# EAGLE design node2 (EAGLE 5.10)
OSRAM-LGN971: GREEN
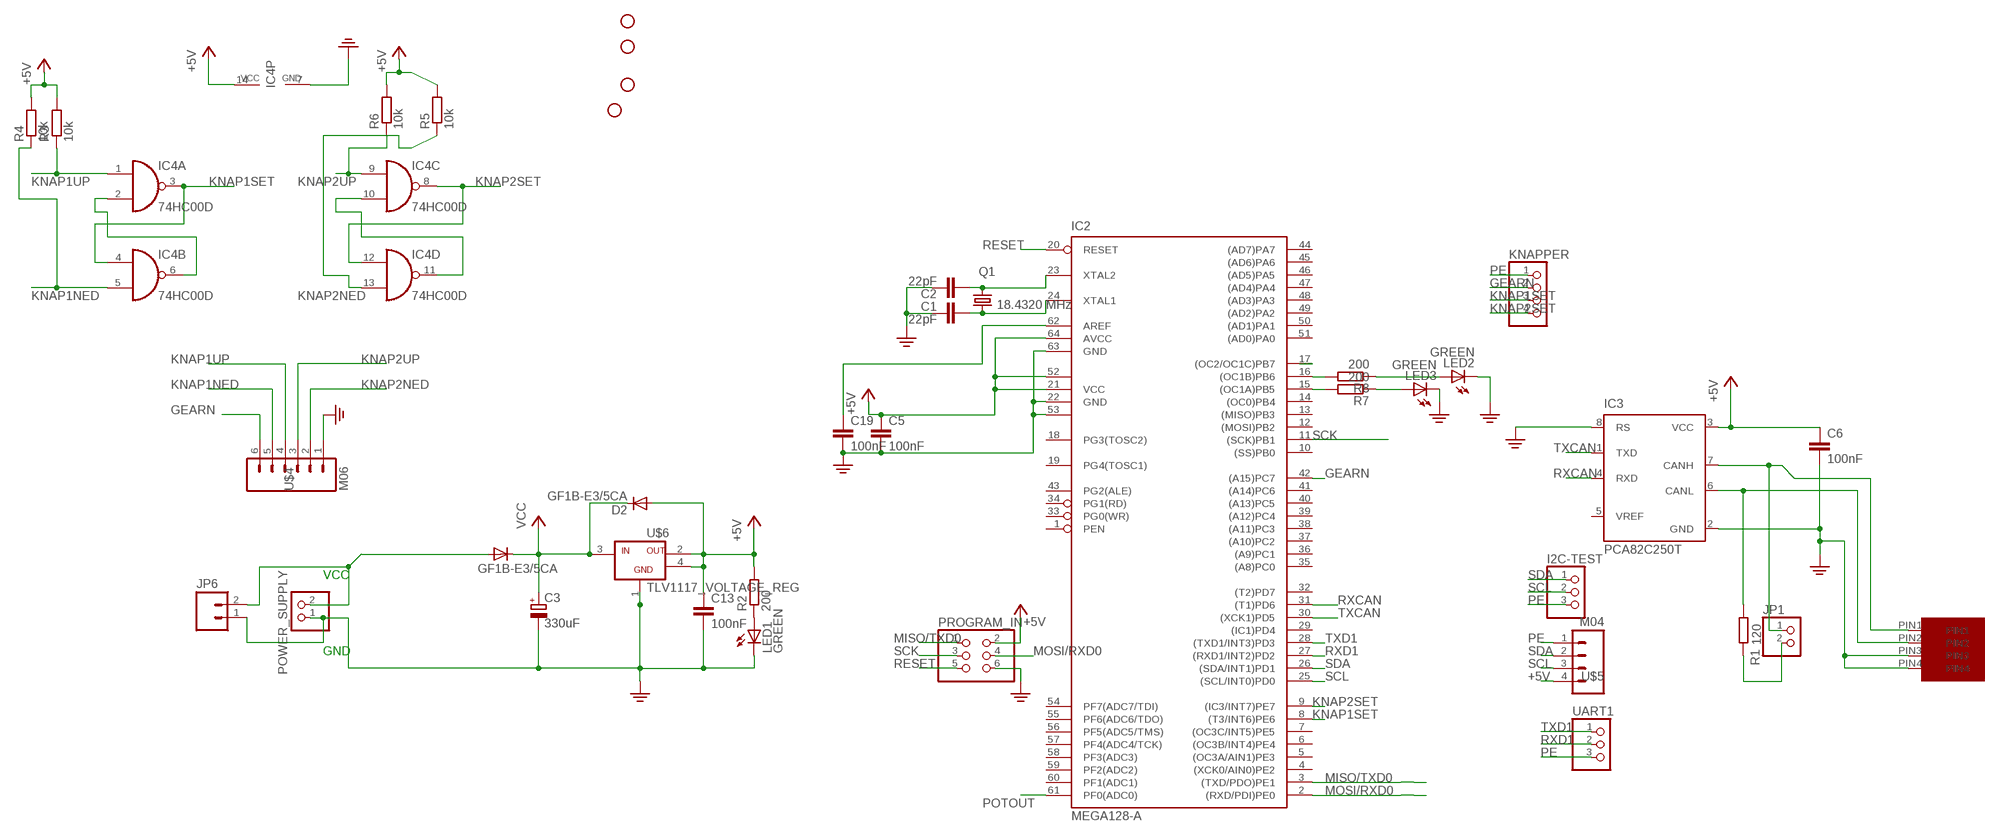
[diagram p0: schematic, sheet 1]

## Parts
C1  22pF  C5/2.5  [C5B2.5]
C2  22pF  C5/2.5  [C5B2.5]
C3  330uF  CPOL-EUE15-5AXIAL  [E15-5]
C5  100nF  C-EUC0603K  [C0603K]
C6  100nF  C-EUC0603K  [C0603K]
C13  100nF  C-EUC0603K  [C0603K]
C19  100nF  C-EUC0603K  [C0603K]
D1  GF1B-E3/5CA  DIODE-GF1  [GF1]
D2  GF1B-E3/5CA  DIODE-GF1  [GF1]
I2C-TEST  PINHD-1X3  [1X03]
IC2  MEGA128-A  [TQFP64]
IC3  PCA82C250T  [SO8]
IC4  74HC00D  [SO14]
JP1  PINHD-1X2  [1X02]
JP2  STAND-OFF  [STAND-OFF]
JP3  STAND-OFF  [STAND-OFF]
JP4  STAND-OFF  [STAND-OFF]
JP5  STAND-OFF  [STAND-OFF]
JP6  M02-JST-2MM-SMT  [S2B-PH]
KNAPPER  PINHD-1X4  [1X04]
LED1  GREEN  LEDSMT1206  [1206]
LED2  GREEN  LEDSMT1206  [1206]
LED3  GREEN  LEDSMT1206  [1206]
POWER_SUPPLY  PINHD-1X2  [1X02]
PROGRAM_IN  PINHD-2X3  [2X03]
Q1  18.4320 MHz  CRYSTALHC49U70  [HC49U70]
R1  120  R-EU_R0603  [R0603]
R2  200  R-EU_R0603  [R0603]
R3  10k  R-EU_R0603  [R0603]
R4  10k  R-EU_R0603  [R0603]
R5  10k  R-EU_R0603  [R0603]
R6  10k  R-EU_R0603  [R0603]
R7  200  R-EU_R0603  [R0603]
R8  200  R-EU_R0603  [R0603]
U$1  MICROFIT4  [MICROFIT4SOCK]
U$4  M06  [S6B_PH]
U$5  M04  [S4B-PH]
U$6  TLV1117_VOLTAGE_REG  [SOT-232]
UART1  PINHD-1X3  [1X03]

## Nets
+5V: C5.1 C6.1 C13.1 D2.A IC2.21(VCC) IC2.52(VCC1) IC2.64(AVCC) IC3.3(VCC) IC4.14(P:VCC) PROGRAM_IN.2 R2.2 R3.2 R4.2 R5.2 R6.2 U$5.4 U$6.2(VOUT) U$6.4(OUT2)
CANJUMP1: IC3.7(CANH) JP1.1 U$1.PIN1
CANJUMP2: JP1.2 R1.2
GEARN: IC2.42((A15)PC7) KNAPPER.2 U$4.6
KNAP1NED: IC4.5(B:I1) R4.1 U$4.5
KNAP1SET: IC2.8((T3/INT6)PE6) IC4.3(A:O) IC4.4(B:I0) KNAPPER.3
KNAP1UP: IC4.1(A:I0) R3.1 U$4.4
KNAP2NED: IC4.13(D:I1) R5.1 U$4.2
KNAP2SET: IC2.9((IC3/INT7)PE7) IC4.8(C:O) IC4.12(D:I0) KNAPPER.4
KNAP2UP: IC4.9(C:I0) R6.1 U$4.3
MISO/TXD0: IC2.3((TXD/PDO)PE1) PROGRAM_IN.1
MOSI/RXD0: IC2.2((RXD/PDI)PE0) PROGRAM_IN.4
N$1: C1.2 IC2.24(XTAL1) Q1.1
N$2: C2.2 IC2.23(XTAL2) Q1.2
N$3: D1.A JP6.2 POWER_SUPPLY.2
N$4: IC2.16((OC1B)PB6) R8.2
N$5: IC2.15((OC1A)PB5) R7.2
N$6: LED1.A R2.1
N$7: LED2.A R8.1
N$9: IC2.17((OC2/OC1C)PB7)
N$10: C19.1 IC2.62(AREF)
N$11: LED3.A R7.1
N$13: IC4.2(A:I1) IC4.6(B:O)
N$15: IC4.10(C:I1) IC4.11(D:O)
N$51: IC3.6(CANL) R1.1 U$1.PIN2
PE: C1.1 C2.1 C3.- C5.2 C6.2 C13.2 C19.2 I2C-TEST.3 IC2.22(GND) IC2.53(GND1) IC2.63(GND) IC3.2(GND) IC3.8(RS) IC4.7(P:GND) JP6.1 KNAPPER.1 LED1.C LED2.C LED3.C POWER_SUPPLY.1 PROGRAM_IN.6 U$1.PIN3 U$1.PIN4 U$4.1 U$5.1 U$6.1(GND) UART1.3
POTOUT: IC2.61(PF0(ADC0))
RESET: IC2.20(RESET) PROGRAM_IN.5
RXCAN: IC2.31((T1)PD6) IC3.4(RXD)
RXD1: IC2.27((RXD1/INT2)PD2) UART1.2
SCK: IC2.11((SCK)PB1) PROGRAM_IN.3
SCL: I2C-TEST.2 IC2.25((SCL/INT0)PD0) U$5.3
SDA: I2C-TEST.1 IC2.26((SDA/INT1)PD1) U$5.2
TXCAN: IC2.30((XCK1)PD5) IC3.1(TXD)
TXD1: IC2.28((TXD1/INT3)PD3) UART1.1
VCC: C3.+ D1.C D2.C U$6.3(VIN)
Unconnected: IC2.1(PEN) IC2.4((XCK0/AIN0)PE2) IC2.5((OC3A/AIN1)PE3) IC2.6((OC3B/INT4)PE4) IC2.7((OC3C/INT5)PE5) IC2.10((SS)PB0) IC2.12((MOSI)PB2) IC2.13((MISO)PB3) IC2.14((OC0)PB4) IC2.18(PG3(TOSC2)) IC2.19(PG4(TOSC1)) IC2.29((IC1)PD4) IC2.32((T2)PD7) IC2.33(PG0(WR)) IC2.34(PG1(RD)) IC2.35((A8)PC0) IC2.36((A9)PC1) IC2.37((A10)PC2) IC2.38((A11)PC3) IC2.39((A12)PC4) IC2.40((A13)PC5) IC2.41((A14)PC6) IC2.43(PG2(ALE)) IC2.44((AD7)PA7) IC2.45((AD6)PA6) IC2.46((AD5)PA5) IC2.47((AD4)PA4) IC2.48((AD3)PA3) IC2.49((AD2)PA2) IC2.50((AD1)PA1) IC2.51((AD0)PA0) IC2.54(PF7(ADC7/TDI)) IC2.55(PF6(ADC6/TDO)) IC2.56(PF5(ADC5/TMS)) IC2.57(PF4(ADC4/TCK)) IC2.58(PF3(ADC3)) IC2.59(PF2(ADC2)) IC2.60(PF1(ADC1)) IC3.5(VREF)

## Notes on the sheet
- VCC
- GND

## Library data of the parts
C1 C2 = capacitor-wima:C: CAPACITOR naming: grid - package width
C3 = rcl:CPOL-EU: POLARIZED CAPACITOR, European symbol
C5 C6 C13 C19 = rcl:C-EU: CAPACITOR, European symbol
D1 D2 = diode:DIODE-: DIODE
I2C-TEST UART1 = pinhead:PINHD-1X3: PIN HEADER
IC2 = atmel:MEGA128: MICROCONTROLLER 128 Kbytes FLASH 4 Kbytes SRAM 4 Kbytes EEPROM DUAL USART 8-channel 10 bit ADC Source: avr.lbr
IC3 = micro-philips:PCA82C250: CAN CONTROLLER INTERFACE
IC4 = 74xx-eu:74*00: Quad 2-input NAND gate
JP1 POWER_SUPPLY = pinhead:PINHD-1X2: PIN HEADER
JP2-JP5 = SparkFun:STAND-OFF: Stand Off This is the mechanical footprint for a #4 phillips button head screw. Use the keepout ring to avoid running the screw head into surrounding components. SKU : PRT-00447
JP6 = unicorn_v2:M02: Header 2 Standard 2-pin 0.1" header. Use with straight break away headers (SKU : PRT-00116), right angle break away headers (PRT-00553), swiss pins (PRT-00743), machine pins (PRT-00117), and female headers (PRT-00115). Molex polarized connector foot print use with SKU : PRT-08233 with associated crimp pins and housings.
KNAPPER = pinhead:PINHD-1X4: PIN HEADER
LED1-LED3 = led:LED: LED OSRAM: - CHIPLED LG R971, LG N971, LY N971, LG Q971, LY Q971, LO R971, LY R971 LH N974, LH R974 LS Q976, LO Q976, LY Q976 LO Q996 - Hyper CHIPLED LW Q18S LB Q993, LB Q99A, LB R99A - SideLED LS A670, LO A670, LY A670, LG A670, LP A670 LB A673, LV A673, LT A673, LW A673 LH A674 LY A675 LS A676, LA A676, LO A676, LY A676, LW A676 LS A679, LY A679, LG A679 - Hyper Micro SIDELED® LS Y876, LA Y876, LO Y876, LY Y876 LT Y87S - SmartLED LW L88C, LW L88S LB L89C, LB L89S, LG L890 LS L89K, LO L89K, LY L89K LS L896, LA L896, LO L896, LY L896 - TOPLED LS T670, LO T670, LY T670, LG T670, LP T670 LSG T670, LSP T670, LSY T670, LOP T670, LYG T670 LG T671, LOG T671, LSG T671 LB T673, LV T673, LT T673, LW T673 LH T674 LS T676, LA T676, LO T676, LY T676, LB T676, LH T676, LSB T676, LW T676 LB T67C, LV T67C, LT T67C, LS T67K, LO T67K, LY T67K, LW E67C LS E67B, LA E67B, LO E67B, LY E67B, LB E67C, LV E67C, LT E67C LW T67C LS T679, LY T679, LG T679 LS T770, LO T770, LY T770, LG T770, LP T770 LB T773, LV T773, LT T773, LW T773 LH T774 LS E675, LA E675, LY E675, LS T675 LS T776, LA T776, LO T776, LY T776, LB T776 LHGB T686 LT T68C, LB T68C - Hyper Mini TOPLED® LB M676 - Mini TOPLED Santana® LG M470 LS M47K, LO M47K, LY M47K Source: http://www.osram.convergy.de LUXEON: - LUMILED® LXK2-PW12-R00, LXK2-PW12-S00, LXK2-PW14-U00, LXK2-PW14-V00 LXK2-PM12-R00, LXK2-PM12-S00, LXK2-PM14-U00 LXK2-PE12-Q00, LXK2-PE12-R00, LXK2-PE12-S00, LXK2-PE14-T00, LXK2-PE14-U00 LXK2-PB12-K00, LXK2-PB12-L00, LXK2-PB12-M00, LXK2-PB14-N00, LXK2-PB14-P00, LXK2-PB14-Q00 LXK2-PR12-L00, LXK2-PR12-M00, LXK2-PR14-Q00, LXK2-PR14-R00 LXK2-PD12-Q00, LXK2-PD12-R00, LXK2-PD12-S00 LXK2-PH12-R00, LXK2-PH12-S00 LXK2-PL12-P00, LXK2-PL12-Q00, LXK2-PL12-R00 Source: www.luxeon.com KINGBRIGHT: KA-3528ASYC Source: www.kingbright.com
PROGRAM_IN = pinhead:PINHD-2X3: PIN HEADER
Q1 = crystal:CRYSTAL: CRYSTAL
R1 = resistor:R-EU_: RESISTOR, European symbol
R2-R8 = rcl:R-EU_: RESISTOR, European symbol
U$1 = UNICORN:MICROFIT4
U$4 = unicorn_v2:M06
U$5 = unicorn_v2:M04
U$6 = unicorn_v2:TLV1117_VOLTAGE_REG

## Board
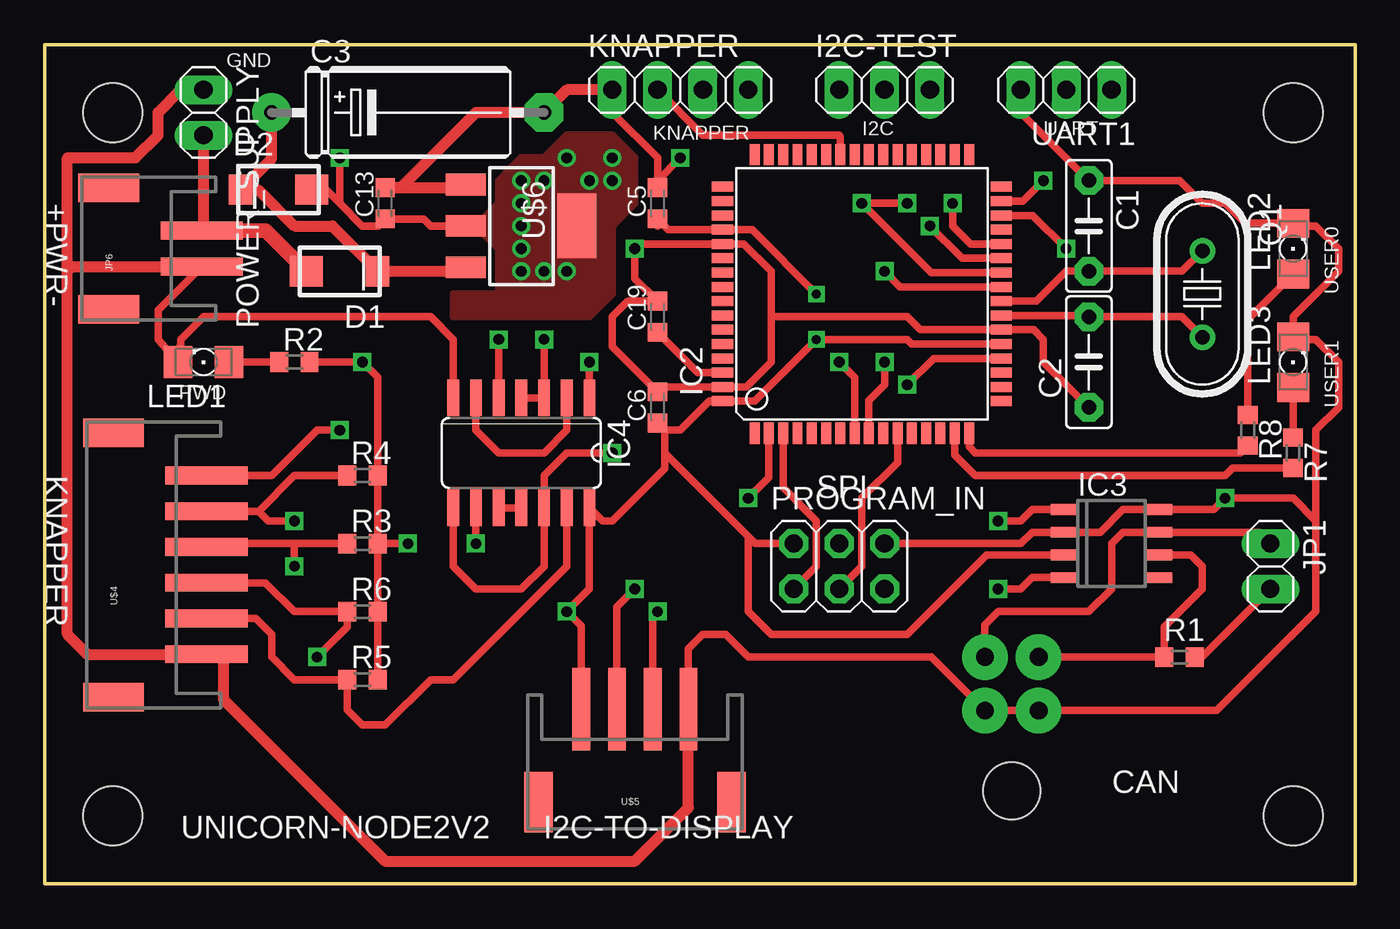
[diagram p1: board, top side]
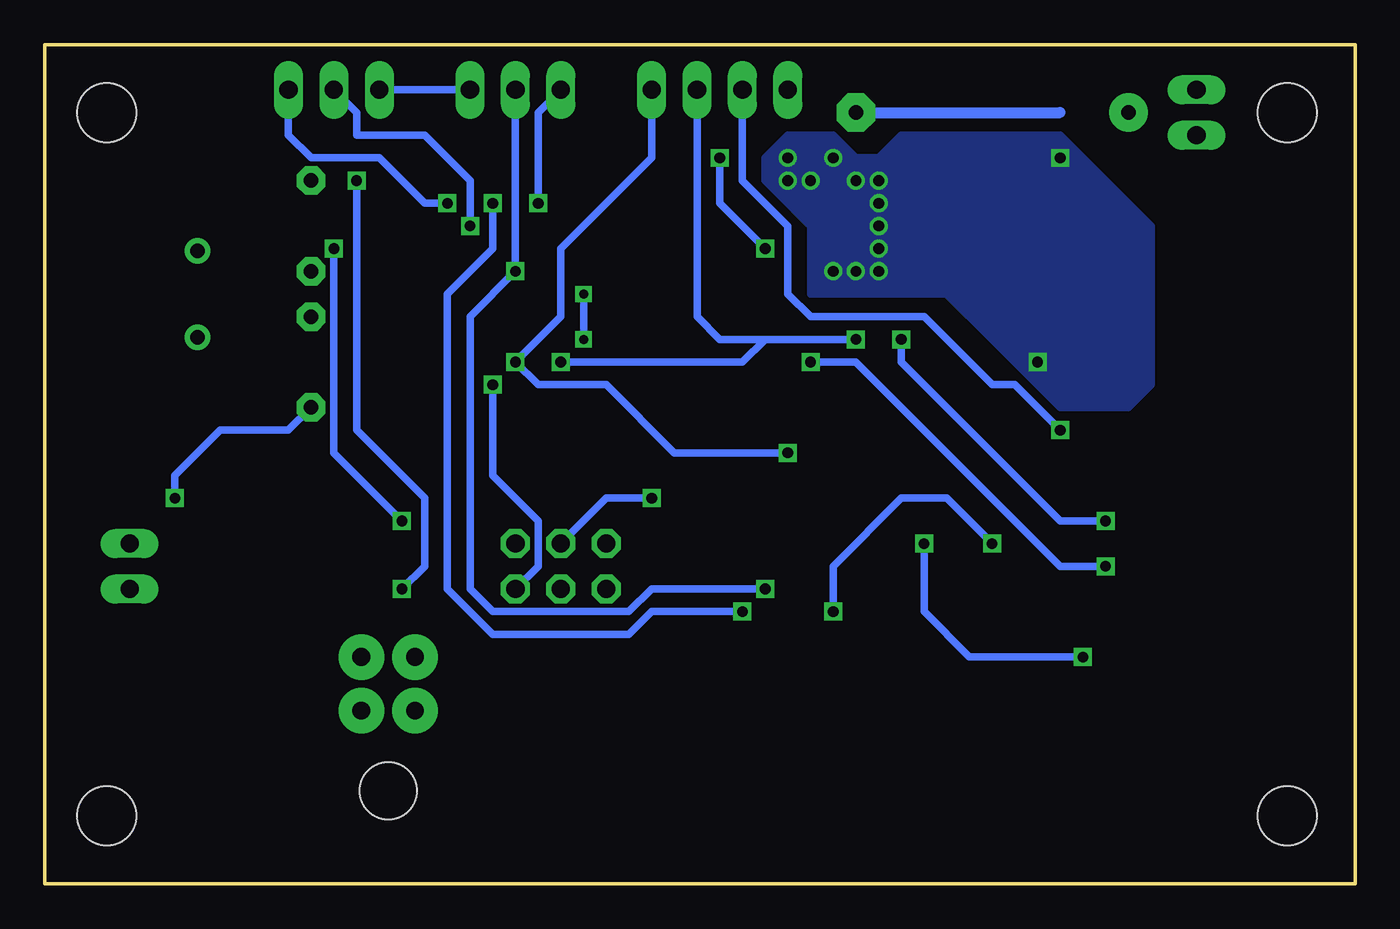
[diagram p2: board, bottom side, seen from below]

Size 73.33 x 46.98 mm. Coordinates in mm from the lower left corner, seen from the top.
Outline: 0,0 73.33,0 73.33,46.98 0,46.98 0,0
Copper layers (1*16): Top 0.035mm / dielectric 1.5mm / Bottom 0.035mm
Design rules "unicorn *": minimum track width 10mil, minimum drill 20mil, track to track 8mil, track to pad 8mil, pad to pad 8mil, via to via 8mil, smd to smd 8mil, copper to edge 10mil, drill to drill 8mil, minimum pad ring 12mil, minimum via ring 8mil, stop-mask expansion 4mil, vias tented up to drill 0mil, thermal gap 10mil

### Footprints (pad centres in the part's own frame; a part is rotated, then mirrored left to right if it is on the bottom)
C5B2.5 = drill 0.813 pad 1.6 octagon: 1 -2.54,0; 2 2.54,0
E15-5 = drill 0.813 pad 2.159 round: + -7.62,0 | drill 0.813 pad 2.159 octagon: - 7.62,0
C0603K = smd 1.05 x 1.08: 1 -0.875,0; 2 0.875,0
GF1 = smd 1.85 x 1.68: A 1.87,0 | smd 1.32 x 1.68: C -2.12,0
1X03 = drill 1.016 long: 1 -2.54,0; 2 0,0; 3 2.54,0
TQFP64 = smd 1.194 x 0.559: 1 -7.8,6; 2 -7.8,5.2; 3 -7.8,4.4; 4 -7.8,3.6; 5 -7.8,2.8; 6 -7.8,2; 7 -7.8,1.2; 8 -7.8,0.4; 9 -7.8,-0.4; 10 -7.8,-1.2; 11 -7.8,-2; 12 -7.8,-2.8; 13 -7.8,-3.6; 14 -7.8,-4.4; 15 -7.8,-5.2; 16 -7.8,-6; 33 7.8,-6; 34 7.8,-5.2; 35 7.8,-4.4; 36 7.8,-3.6; 37 7.8,-2.8; 38 7.8,-2; 39 7.8,-1.2; 40 7.8,-0.4; 41 7.8,0.4; 42 7.8,1.2; 43 7.8,2; 44 7.8,2.8; 45 7.8,3.6; 46 7.8,4.4; 47 7.8,5.2; 48 7.8,6 | smd 0.559 x 1.194: 17 -6,-7.8; 18 -5.2,-7.8; 19 -4.4,-7.8; 20 -3.6,-7.8; 21 -2.8,-7.8; 22 -2,-7.8; 23 -1.2,-7.8; 24 -0.4,-7.8; 25 0.4,-7.8; 26 1.2,-7.8; 27 2,-7.8; 28 2.8,-7.8; 29 3.6,-7.8; 30 4.4,-7.8; 31 5.2,-7.8; 32 6,-7.8; 49 6,7.8; 50 5.2,7.8; 51 4.4,7.8; 52 3.6,7.8; 53 2.8,7.8; 54 2,7.8; 55 1.2,7.8; 56 0.4,7.8; 57 -0.4,7.8; 58 -1.2,7.8; 59 -2,7.8; 60 -2.8,7.8; 61 -3.6,7.8; 62 -4.4,7.8; 63 -5.2,7.8; 64 -6,7.8
SO8 = smd 0.6 x 1.6: 1 -1.905,-2.6; 2 -0.635,-2.6; 3 0.635,-2.6; 4 1.905,-2.6; 5 1.905,2.6; 6 0.635,2.6; 7 -0.635,2.6; 8 -1.905,2.6
SO14 = smd 0.66 x 2.032: 1 -3.81,-3.073; 2 -2.54,-3.073; 3 -1.27,-3.073; 4 0,-3.073; 5 1.27,-3.073; 6 2.54,-3.073; 7 3.81,-3.073; 8 3.81,3.073; 9 2.54,3.073; 10 1.27,3.073; 11 0,3.073; 12 -1.27,3.073; 13 -2.54,3.073; 14 -3.81,3.073
1X02 = drill 1.016 long: 1 -1.27,0; 2 1.27,0
STAND-OFF = hole 3.302: 0,0
S2B-PH = smd 1 x 4.6: 1 -1,-3.7; 2 1,-3.7 | smd 1.6 x 3.4: NC1 -3.4,1.5; NC2 3.4,1.5
1X04 = drill 1.016 long: 1 -3.81,0; 2 -1.27,0; 3 1.27,0; 4 3.81,0
1206 = smd 1.6 x 1.803: A -1.422,0; C 1.422,0
2X03 = drill 1.016 octagon: 1 -2.54,-1.27; 2 -2.54,1.27; 3 0,-1.27; 4 0,1.27; 5 2.54,-1.27; 6 2.54,1.27
HC49U70 = drill 0.813 round: 1 -2.413,0; 2 2.413,0
R0603 = smd 1 x 1.1: 1 -0.85,0; 2 0.85,0
MICROFIT4SOCK = drill 1 pad 2.54 round: PIN1 -2,0; PIN2 1,0; PIN3 -2,-3; PIN4 1,-3 | hole 3.2: -0.5,-7.5
S6B_PH = smd 1 x 4.6: 1 -4.92,-2.7; 2 -2.92,-2.7; 3 -0.92,-2.7; 4 1.08,-2.7; 5 3.08,-2.7; 6 5.08,-2.7 | smd 1.6 x 3.4: NC1 -7.32,2.5; NC2 7.48,2.5
S4B-PH = smd 1 x 4.6: 1 -3,-2.16; 2 -1,-2.16; 3 1,-2.16; 4 3,-2.16 | smd 1.6 x 3.4: NC1 -5.4,3.04; NC2 5.4,3.04
SOT-232 = smd 1.219 x 2.235: 1 -2.311,-3.099; 2 0,-3.099; 3 2.311,-3.099 | smd 3.6 x 2.2: 4 0,3.099

### Placement (x,y rotation side)
C1  58.42,36.83 270 top
C2  58.42,29.21 90 top
C3  20.32,43.18 0 top
C5  34.29,38.1 90 top
C6  34.29,26.67 90 top
C13  19.05,38.1 90 top
C19  34.29,31.75 90 top
D1  16.51,34.29 180 top
D2  13.08,38.86 0 top
I2C-TEST  46.99,44.45 0 top
IC2  45.72,33.02 90 top
IC3  59.69,19.05 270 top
IC4  26.67,24.13 180 top
JP1  68.58,17.78 270 top
JP2  3.81,3.81 0 top
JP3  69.85,3.81 0 top
JP4  3.81,43.18 0 top
JP5  69.85,43.18 0 top
JP6  5.08,35.56 90 top
KNAPPER  35.56,44.45 0 top
LED1  8.89,29.21 180 top
LED2  69.85,35.56 90 top
LED3  69.85,29.21 90 top
POWER_SUPPLY  8.89,43.18 270 top
PROGRAM_IN  44.45,17.78 0 top
Q1  64.77,33.02 270 top
R1  63.5,12.7 0 top
R2  13.97,29.21 0 top
R3  17.78,19.05 0 top
R4  17.78,22.86 0 top
R5  17.78,11.43 0 top
R6  17.78,15.24 0 top
R7  69.85,24.13 270 top
R8  67.31,25.4 270 top
U$1  54.61,12.7 0 top
U$4  6.35,17.78 90 top
U$5  33.02,7.62 180 top
U$6  26.67,36.83 270 top
UART1  57.15,44.45 180 top

### Tracks (layer width: path | path; a pad name or v marks a point on that pad's centre or on a via)
+5V  (via drill 0.51, 0.6)
  Top 0.406: 16.51,38.1 17.78,36.83 18.66,36.83 C13.1 21.2,37.23 21.59,36.83 U$6.2 | R5.2 R6.2 R3.2 | R3.2 R4.2 18.63,28.36 v17.78,29.21 R2.2 | IC2.21 48.52,30.22 48.26,30.48 v43.18,30.48 39.72,27.02 IC2.64 37.18,27.02 35.56,25.4 34.69,25.4 | 34.69,25.4 C6.1 | 16.51,38.1 v16.51,40.64 | 34.69,24.13 34.69,25.4 | 34.69,24.13 34.69,23.25 31.75,20.32 31.22,20.32 30.85,20.69 | 30.85,20.69 IC4.14 | 30.85,20.69 30.48,20.32 30.48,16.51 v29.21,15.24 30.02,14.43 U$5.4 | PROGRAM_IN.2 39.77,19.05 39.37,19.45 | R3.2 v20.32,19.05 | IC3.3 52.7,18.41 48.26,13.97 40.64,13.97 39.37,15.24 39.37,19.45 | 34.69,24.13 39.37,19.45 | 34.29,36.83 C5.1 34.9,36.62 IC2.52 39.58,36.62 v43.18,33.02 | D2.A 15.75,38.86 16.51,38.1
  Bottom 0.406: v20.32,19.05 22.86,21.59 25.4,21.59 29.21,17.78 v29.21,15.24 | v43.18,30.48 v43.18,33.02
  other vias: 31.75,40.64 31.75,39.37 30.48,39.37 26.67,39.37 27.94,39.37 26.67,38.1 26.67,35.56 26.67,34.29 27.94,34.29 26.67,36.83 29.21,34.29 29.21,40.64
  pour Bottom (no thermals): 31.75,41.91 29.21,41.91 27.94,40.64 26.67,40.64 25.4,41.91 16.51,41.91 11.43,36.83 11.43,27.94 12.7,26.67 16.51,26.67 22.86,33.02 30.48,33.02 30.48,36.83 33.02,39.37 33.02,40.64
  pour Top (isolate 0.305, no thermals): 33.02,38.1 33.02,40.64 31.75,41.91 29.21,41.91 27.94,40.64 26.67,40.64 25.4,39.37 25.4,38.1 24.13,36.83 25.4,35.56 25.4,33.02 22.86,33.02 22.86,31.75 30.48,31.75 31.75,33.02 31.75,36.83
CANJUMP1
  Top 0.406: U$1.PIN1 52.61,14.51 53.34,15.24 58.42,15.24 59.69,16.51 59.69,19.05 60.33,19.68 IC3.7 67.94,19.68 JP1.1
CANJUMP2
  Top 0.406: R1.2 64.77,12.7 JP1.2
GEARN  (via drill 0.6)
  Top 0.406: IC2.42 44.52,41.84 44.45,41.91 36.83,41.91 KNAPPER.2 | v16.51,25.4 15.24,25.4 12.7,22.86 U$4.6
  Bottom 0.406: KNAPPER.2 34.29,39.37 31.75,36.83 31.75,33.02 30.48,31.75 24.13,31.75 20.32,27.94 19.05,27.94 v16.51,25.4
KNAP1NED  (via drill 0.6)
  Top 0.406: U$4.5 11.97,20.86 | 11.97,20.86 13.97,22.86 R4.1 | v25.4,30.48 IC4.5 | v13.97,20.32 12.51,20.32 11.97,20.86
  Bottom 0.406: v13.97,20.32 16.51,20.32 25.4,29.21 v25.4,30.48
KNAP1SET  (via drill 0.6)
  Top 0.406: IC4.4 IC4.3 v27.94,30.48 | IC2.8 45.32,28.34 v44.45,29.21
  Bottom 0.406: v44.45,29.21 34.29,29.21 33.02,30.48 | v27.94,30.48 33.02,30.48 | 33.02,30.48 35.56,30.48 36.83,31.75 KNAPPER.3
KNAP1UP  (via drill 0.6)
  Top 0.406: v30.48,29.21 IC4.1 | 13.97,19.05 v13.97,17.78 | 13.97,19.05 R3.1 | 13.97,19.05 9.24,19.05 U$4.4
  Bottom 0.406: v30.48,29.21 27.94,29.21 16.51,17.78 v13.97,17.78
KNAP2NED
  Top 0.406: U$4.2 11.81,14.86 12.7,13.97 12.7,12.7 13.97,11.43 R5.1 16.93,9.74 17.78,8.89 19.05,8.89 21.59,11.43 22.86,11.43 29.21,17.78 IC4.13
KNAP2SET  (via drill 0.6)
  Top 0.406: IC4.8 22.86,17.78 24.13,16.51 26.67,16.51 27.94,17.78 IC4.12 27.94,22.86 29.21,24.13 v31.75,24.13 | v46.99,29.21 46.99,27.94 46.12,27.07 IC2.9
  Bottom 0.406: v31.75,24.13 38.1,24.13 41.91,27.94 45.72,27.94 v46.99,29.21 44.45,31.75 44.45,35.56 39.37,40.64 KNAPPER.4
KNAP2UP  (via drill 0.6)
  Top 0.406: U$4.3 12.35,16.86 13.97,15.24 R6.1 16.93,14.39 v15.24,12.7 | v24.13,19.05 IC4.9
  Bottom 0.406: v15.24,12.7 21.59,12.7 24.13,15.24 v24.13,19.05
MISO/TXD0
  Top 0.406: IC2.3 41.32,22.18 43.18,20.32 43.18,17.78 PROGRAM_IN.1
MOSI/RXD0  (via drill 0.6)
  Top 0.406: IC2.2 40.52,22.74 v39.37,21.59
  Bottom 0.406: v39.37,21.59 41.91,21.59 PROGRAM_IN.4
N$1
  Top 0.406: IC2.24 55.48,32.62 57.15,34.29 C1.2 63.63,34.29 Q1.1
N$2
  Top 0.406: IC2.23 58.35,31.82 C2.2 63.63,31.75 Q1.2
N$3
  Top 0.61: POWER_SUPPLY.2 8.89,36.67 JP6.2
  Top 0.813: JP6.2 12.37,36.56 D1.A
N$4
  Top 0.406: IC2.16 51.72,24.48 52.07,24.13 66.89,24.13 R8.2
N$5
  Top 0.406: IC2.15 50.92,24.01 52.07,22.86 66.04,22.86 66.46,23.28 R7.2
N$6
  Top 0.406: LED1.A R2.1
N$7
  Top 0.406: R8.1 67.31,31.6 LED2.A
N$10
  Top 0.406: IC2.62 36.55,28.62 C19.1
N$11
  Top 0.406: R7.1 LED3.A
N$13
  Top 0.406: IC4.6 24.13,25.4 25.4,24.13 27.94,24.13 29.21,25.4 IC4.2
N$15
  Top 0.406: IC4.11 IC4.10
N$51
  Top 0.406: U$1.PIN2 R1.1 62.65,14.39 64.77,16.51 64.77,17.78 64.14,18.41 IC3.6
PE  (via drill 0.6)
  Top 0.406: KNAPPER.1 31.75,43.18 34.29,40.64 C5.2 34.29,39.37 v35.56,40.64 | UART1.3 54.61,43.18 C1.1 63.5,39.37 64.77,38.1 66.04,38.1 67.16,36.98 LED2.C 70,36.83 71.12,36.83 72.39,35.56 72.39,34.29 69.85,31.75 LED3.C 70,30.48 71.12,30.48 72.39,29.21 72.39,26.67 71.12,25.4 71.12,20.32 | C2.1 55.88,29.21 55.88,30.48 55.34,31.02 IC2.22 48.99,31.02 48.26,31.75 40.64,31.75 | PROGRAM_IN.6 54.61,19.05 55.24,19.68 IC3.2 59.05,19.68 60.33,20.95 IC3.8 65.41,20.95 v66.04,21.59 69.85,21.59 71.12,20.32 | 71.12,20.32 71.12,15.24 65.58,9.7 U$1.PIN4 U$1.PIN3 49.61,12.7 39.37,12.7 38.1,13.97 36.83,13.97 36.02,13.16 U$5.1 | LED1.C 7.62,30.33 | LED1.C 6.35,30.48 6.35,32.13 JP6.1 | IC4.7 22.86,30.48 21.59,31.75 8.89,31.75 7.62,30.48 7.62,29.36 LED1.C | 40.64,31.75 40.64,29.21 39.25,27.82 IC2.63 34.56,27.82 C6.2 31.75,30.09 31.75,31.75 32.62,32.62 C19.2 33.02,33.9 v33.02,35.56 33.28,35.82 IC2.53 39.11,35.82 40.64,34.29 40.64,31.75
  Top 0.61: KNAPPER.1 29.21,44.45 C3.- 24.13,43.18 19.93,38.98 C13.2 23.41,38.98 U$6.1 | U$5.1 36.02,4.27 33.02,1.27 19.05,1.27 10,10.32 10,12.86 U$4.1 8.89,12.7 7.62,12.7 7.46,12.86 2.38,12.86 1.27,13.97 1.27,34.29 | JP6.1 1.54,34.56 1.27,34.29 | 1.27,34.29 1.27,40.64 5.08,40.64 6.35,41.91 6.35,43.18 7.62,44.45 POWER_SUPPLY.1
  Bottom 0.406: v35.56,40.64 35.56,38.1 v33.02,35.56 | UART1.3 I2C-TEST.3 | v66.04,21.59 66.04,22.86 63.5,25.4 59.69,25.4 C2.1
  Bottom 0.61: C3.- 16.51,43.18
RESET  (via drill 0.6)
  Top 0.406: IC2.20 49.74,29.42 v48.26,27.94
  Bottom 0.406: v48.26,27.94 48.26,22.86 45.72,20.32 45.72,17.78 PROGRAM_IN.5
RXCAN  (via drill 0.6)
  Top 0.406: v53.34,16.51 54.61,16.51 55.24,17.14 IC3.4 | IC2.31 54.73,38.22 v55.88,39.37
  Bottom 0.406: v53.34,16.51 52.07,17.78 52.07,21.59 55.88,25.4 v55.88,39.37
RXD1  (via drill 0.6)
  Top 0.406: IC2.27 51.34,35.02 v49.53,36.83
  Bottom 0.406: UART1.2 55.88,43.18 55.88,41.91 52.07,41.91 49.53,39.37 v49.53,36.83
SCK
  Top 0.406: PROGRAM_IN.3 45.72,17.78 45.72,21.59 47.72,23.59 IC2.11
SCL  (via drill 0.6)
  Top 0.406: IC2.25 47.86,33.42 v46.99,34.29 | U$5.3 32.02,15.51 v33.02,16.51
  Bottom 0.406: I2C-TEST.2 v46.99,34.29 49.53,31.75 49.53,16.51 48.26,15.24 40.64,15.24 39.37,16.51 v33.02,16.51
SDA  (via drill 0.6)
  Top 0.406: IC2.26 49.6,34.22 v45.72,38.1 v48.26,38.1 | U$5.2 34.02,14.97 v34.29,15.24
  Bottom 0.406: v45.72,38.1 45.72,43.18 I2C-TEST.1 | v34.29,15.24 39.37,15.24 40.64,13.97 48.26,13.97 50.8,16.51 50.8,33.02 48.26,35.56 v48.26,38.1
TXCAN  (via drill 0.6)
  Top 0.406: IC2.30 55.29,37.42 v57.15,35.56 | v53.34,20.32 54.61,20.32 55.24,20.95 IC3.1
  Bottom 0.406: v57.15,35.56 57.15,24.13 v53.34,20.32
TXD1  (via drill 0.6)
  Top 0.406: IC2.28 51.81,35.82 50.8,36.83 v50.8,38.1
  Bottom 0.406: v50.8,38.1 52.07,38.1 54.61,40.64 58.42,40.64 59.69,41.91 UART1.1
VCC
  Top 0.406: U$6.3 23.09,34.52 22.86,34.29
  Top 0.61: U$6.3 23.34,34.29 D1.C 16.09,36.83 13.97,36.83 11.94,38.86 D2.C 12.7,40.6 C3.+

### Text on the board
tPlace: GND | KNAPPER | I2C | UART | +PWR- | USER0 | PWD | USER1 | KNAPPER | SPI | CAN | I2C-TO-DISPLAY | UNICORN-NODE2V2